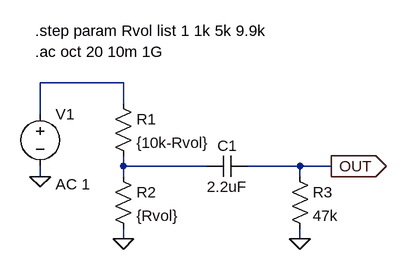
[diagram p0: schematic Headphone Amp input AC coupling.asc]
Headphone Amp input AC coupling.asc, the LTspice schematic file:
Version 4
SHEET 1 880 680
WIRE 208 112 80 112
WIRE 208 144 208 112
WIRE 80 160 80 112
WIRE 208 240 208 224
WIRE 336 240 208 240
WIRE 480 240 400 240
WIRE 528 240 480 240
WIRE 80 256 80 240
WIRE 208 256 208 240
WIRE 480 256 480 240
WIRE 208 352 208 336
WIRE 480 352 480 336
FLAG 80 256 0
FLAG 208 352 0
FLAG 528 240 OUT
IOPIN 528 240 Out
FLAG 480 352 0
SYMBOL cap 400 224 R90
WINDOW 0 0 32 VBottom 2
WINDOW 3 32 32 VTop 2
SYMATTR InstName C1
SYMATTR Value 2.2uF
SYMBOL res 192 128 R0
SYMATTR InstName R1
SYMATTR Value {10k-Rvol}
SYMBOL res 192 240 R0
SYMATTR InstName R2
SYMATTR Value {Rvol}
SYMBOL voltage 80 144 R0
WINDOW 123 24 124 Left 2
WINDOW 39 0 0 Left 2
SYMATTR InstName V1
SYMATTR Value ""
SYMATTR Value2 AC 1
SYMBOL res 464 240 R0
SYMATTR InstName R3
SYMATTR Value 47k
TEXT 72 64 Left 2 !.ac oct 20 10m 1G
TEXT 72 32 Left 2 !.step param Rvol list 1 1k 5k 9.9k

The netlist it stands for:
* Headphone Amp input AC coupling.asc
C1 OUT N002 2.2uF
R1 N001 N002 {10k-Rvol}
R2 N002 0 {Rvol}
V1 N001 0 AC 1
R3 OUT 0 47k
.ac oct 20 10m 1G
.step param Rvol list 1 1k 5k 9.9k
.backanno
.end